# EAGLE board preparedinstruments_0_bechemel_v12_MOTHERBOARD_no_values (EAGLE 9.6.2)
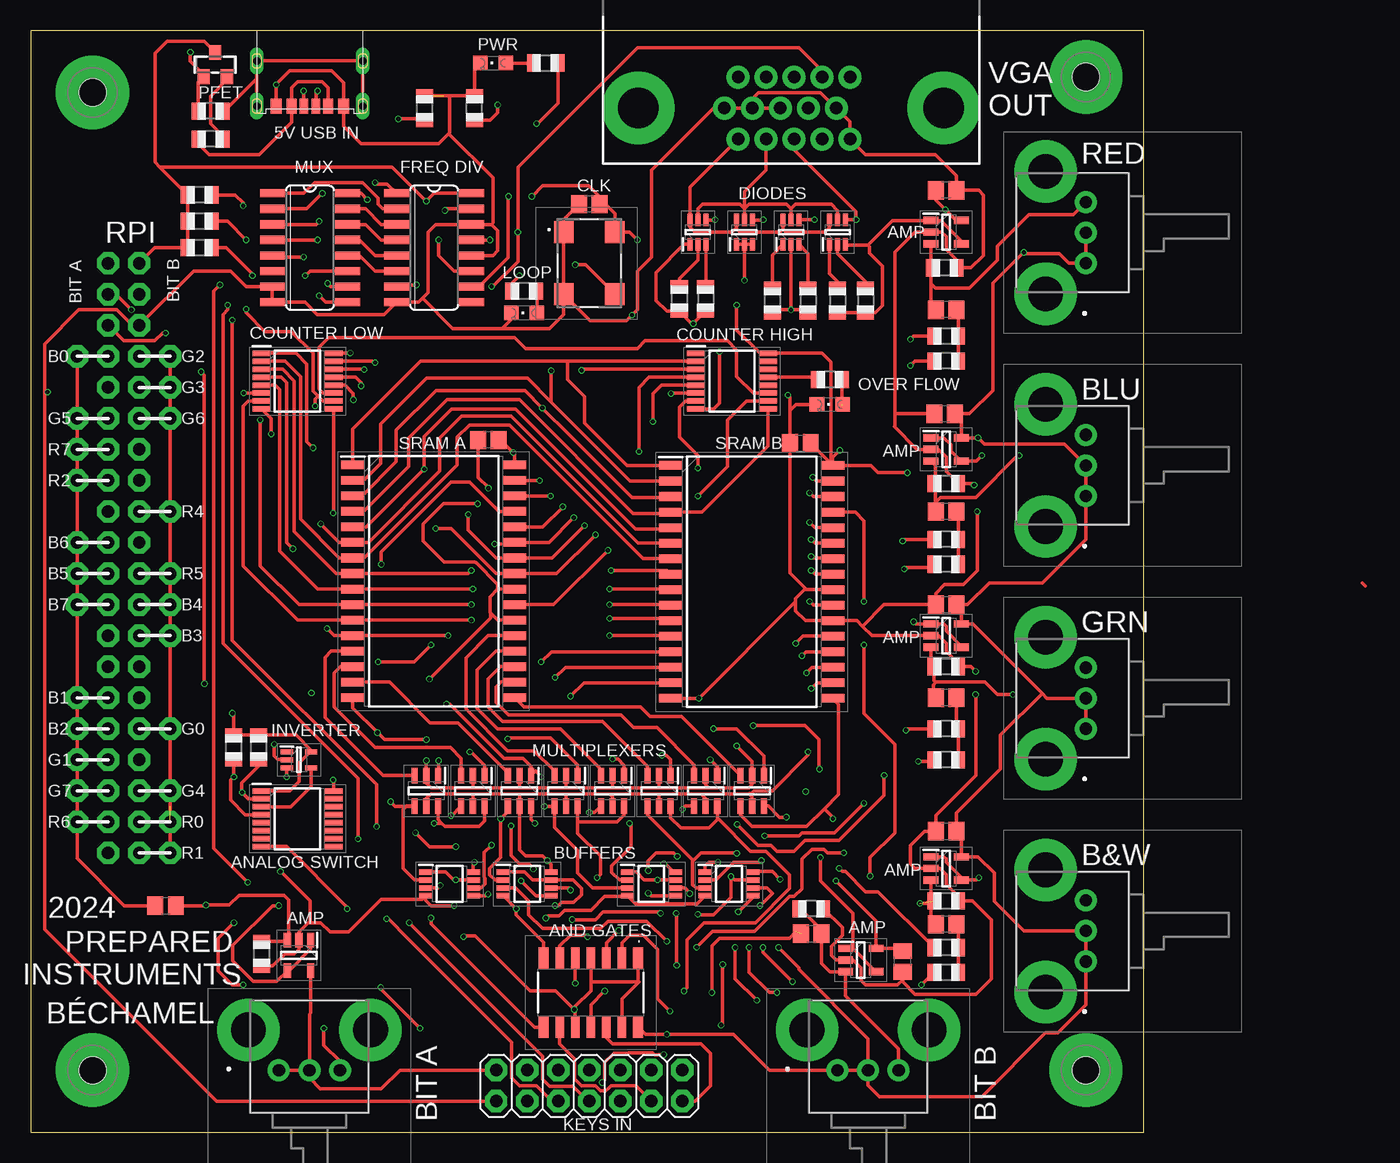
[diagram p5: board, top side]
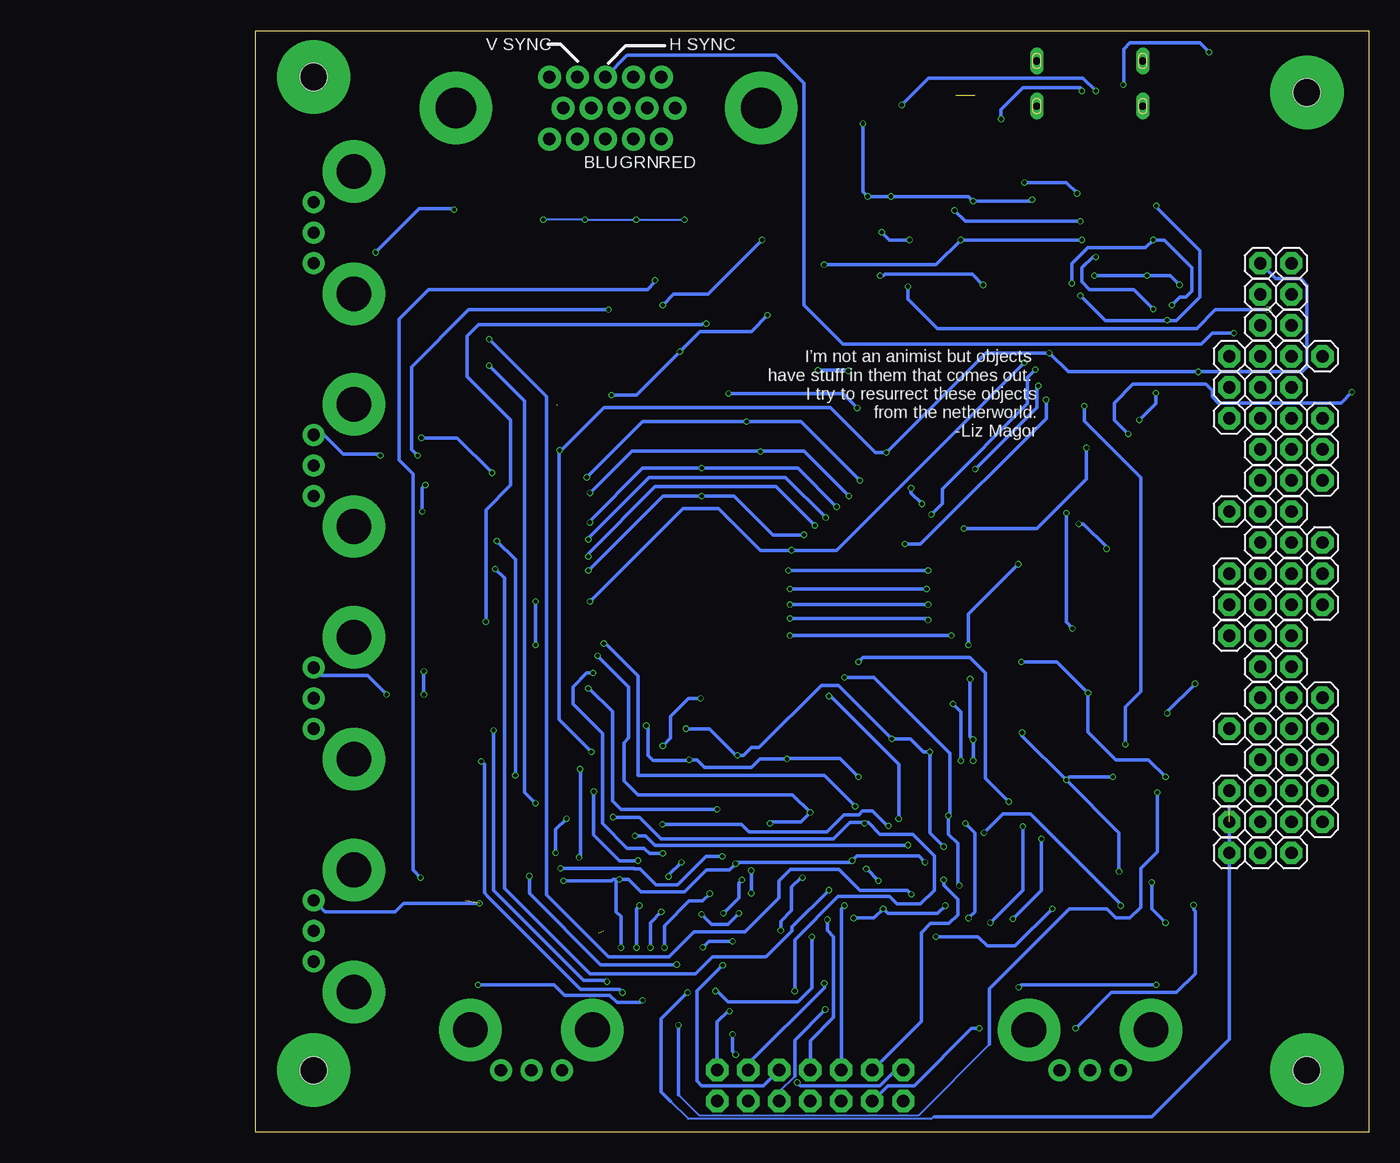
[diagram p6: board, bottom side, seen from below]

Size 91.11 x 90.16 mm. Coordinates in mm from the lower left corner, seen from the top.
Outline: 0,0 91.11,0 91.11,90.16 0,90.16 0,0
Copper layers (1*16): Top 0.035mm / dielectric 1.6mm / Bottom 0.035mm
Design rules "jlcpcb-2layers": minimum track width 5mil, minimum drill 0.3mm, track to track 5mil, track to pad 5mil, pad to pad 5mil, via to via 5mil, smd to smd 5mil, copper to edge 0.2mm, drill to drill 6mil, minimum pad ring 10mil, minimum via ring 3mil, stop-mask expansion 4mil, vias tented up to drill 0mil, thermal gap 10mil

## Footprints (pad centres in the part's own frame; a part is rotated, then mirrored left to right if it is on the bottom)
C0805 = smd 1.3 x 1.5: 1 -0.85,0; 2 0.85,0
SOT65P210X110-6N = smd 1 x 0.4: 1 -1,0.65; 2 -1,0; 3 -1,-0.65; 4 1,-0.65; 5 1,0; 6 1,0.65
R0805 = smd 1.1 x 1.4: 1 -1,0; 2 1,0
SOIC127P1412X305-32N = smd 1.922 x 0.7: 1 -6.614,9.525; 2 -6.614,8.255; 3 -6.614,6.985; 4 -6.614,5.715; 5 -6.614,4.445; 6 -6.614,3.175; 7 -6.614,1.905; 8 -6.614,0.635; 9 -6.614,-0.635; 10 -6.614,-1.905; 11 -6.614,-3.175; 12 -6.614,-4.445; 13 -6.614,-5.715; 14 -6.614,-6.985; 15 -6.614,-8.255; 16 -6.614,-9.525; 17 6.614,-9.525; 18 6.614,-8.255; 19 6.614,-6.985; 20 6.614,-5.715; 21 6.614,-4.445; 22 6.614,-3.175; 23 6.614,-1.905; 24 6.614,-0.635; 25 6.614,0.635; 26 6.614,1.905; 27 6.614,3.175; 28 6.614,4.445; 29 6.614,5.715; 30 6.614,6.985; 31 6.614,8.255; 32 6.614,9.525
SOP65P400X130-8N = smd 1.1 x 0.45: 1 -1.95,0.975; 2 -1.95,0.325; 3 -1.95,-0.325; 4 -1.95,-0.975; 5 1.95,-0.975; 6 1.95,-0.325; 7 1.95,0.325; 8 1.95,0.975
SOT95P275X110-6N = smd 1.25 x 0.5: 1 -1.25,0.95; 2 -1.25,0; 3 -1.25,-0.95; 4 1.25,-0.95; 5 1.25,0; 6 1.25,0.95
SOT95P280X145-5N = smd 1.2 x 0.6: 1 -1.25,0.95; 2 -1.25,0; 3 -1.25,-0.95; 4 1.25,-0.95; 5 1.25,0.95
SO16 = smd 0.66 x 2.032: 1 -4.445,-3.073; 2 -3.175,-3.073; 3 -1.905,-3.073; 4 -0.635,-3.073; 5 0.635,-3.073; 6 1.905,-3.073; 7 3.175,-3.073; 8 4.445,-3.073; 9 4.445,3.073; 10 3.175,3.073; 11 1.905,3.073; 12 0.635,3.073; 13 -0.635,3.073; 14 -1.905,3.073; 15 -3.175,3.073; 16 -4.445,3.073
74LVT08D118 = smd 0.8 x 1.75: 1 -3.86,-2.825; 7 3.86,-2.825; 8 3.86,2.825; 14 -3.86,2.825 | smd 0.7 x 1.75: 2 -2.54,-2.825; 3 -1.27,-2.825; 4 0,-2.825; 5 1.27,-2.825; 6 2.54,-2.825; 9 2.54,2.825; 10 1.27,2.825; 11 0,2.825; 12 -1.27,2.825; 13 -2.54,2.825
SOP65P640X110-16N = smd 1.475 x 0.45: 1 -2.938,2.275; 2 -2.938,1.625; 3 -2.938,0.975; 4 -2.938,0.325; 5 -2.938,-0.325; 6 -2.938,-0.975; 7 -2.938,-1.625; 8 -2.938,-2.275; 9 2.938,-2.275; 10 2.938,-1.625; 11 2.938,-0.975; 12 2.938,-0.325; 13 2.938,0.325; 14 2.938,0.975; 15 2.938,1.625; 16 2.938,2.275
1X01 = drill 1.016 octagon: 1 0,0
2X07 = drill 1.016 octagon: 1 -7.62,-1.27; 2 -7.62,1.27; 3 -5.08,-1.27; 4 -5.08,1.27; 5 -2.54,-1.27; 6 -2.54,1.27; 7 0,-1.27; 8 0,1.27; 9 2.54,-1.27; 10 2.54,1.27; 11 5.08,-1.27; 12 5.08,1.27; 13 7.62,-1.27; 14 7.62,1.27
CHIPLED_0805 = smd 1.2 x 1.2: A 0,-1.05; C 0,1.05
STANDOFF_HEX_FEMALE_400X2000_M2X0.4_MTGP600H220 = drill 2.2 pad 6: 1 0,0 | hole 2.2: 0,0
SOT23-WIDE = smd 1 x 1.2: 1 -0.95,-1; 2 0.95,-1; 3 0,1
SOP65P640X120-16N = smd 1.475 x 0.45: 1 -2.938,2.275; 2 -2.938,1.625; 3 -2.938,0.975; 4 -2.938,0.325; 5 -2.938,-0.325; 6 -2.938,-0.975; 7 -2.938,-1.625; 8 -2.938,-2.275; 9 2.938,-2.275; 10 2.938,-1.625; 11 2.938,-0.975; 12 2.938,-0.325; 13 2.938,0.325; 14 2.938,0.975; 15 2.938,1.625; 16 2.938,2.275
SOT65P210X110-5N = smd 1 x 0.4: 1 -1,0.65; 2 -1,0; 3 -1,-0.65; 4 1,-0.65; 5 1,0.65
DB15 = drill 1.016 pad 1.88: 1 -4.32,-7.62; 2 -2.03,-7.62; 3 0.26,-7.62; 4 2.55,-7.62; 5 4.84,-7.62; 6 -5.46,-5.08; 7 -3.17,-5.08; 8 -0.88,-5.08; 9 1.41,-5.08; 10 3.7,-5.08; 11 -4.32,-2.54; 12 -2.03,-2.54; 13 0.26,-2.54; 14 2.55,-2.54; 15 4.84,-2.54 | drill 3.302 pad 5.08: G1 -12.5,-5.08; G2 12.5,-5.08
USCX-06FX-XXMX-01 = smd 0.7 x 1.2: CC1 0.5,-1.75; CC2 -0.5,-1.75 | smd 0.9 x 1.2: GND1 2.75,-1.75; GND2 -2.75,-1.75 | drill 0.6 long: SHIELD1 4.325,1.95; SHIELD2 4.325,-1.75; SHIELD3 -4.35,-1.75; SHIELD4 -4.35,1.95 | smd 0.8 x 1.2: VBUS1 1.5,-1.75; VBUS2 -1.5,-1.75
PTV09A3015FB103 = drill 1 pad 1.5: 1 0,0; 2 2.5,0; 3 5,0 | drill 2.84 pad 4.3: MH1 -2.5,3.3; MH2 7.5,3.3
LFSPXO019137REEL = smd 1.8 x 1.6: 1 -2.54,-2.1; 2 2.54,-2.1; 3 2.54,2.1; 4 -2.54,2.1

## Placement (x,y rotation side)
C1  .1uF  [C0805]  45.72,75.95 180 top
C2  .1uF  [C0805]  74.93,50.8 180 top
C4  .1uF  [C0805]  63.88,16.26 0 top
C7  .1uF  [C0805]  37.47,56.64 180 top
C12  .1uF  [C0805]  11.05,18.54 0 top
C13  .1uF  [C0805]  74.93,77.09 180 top
C17  .1uF  [C0805]  62.99,56.39 0 top
C18  .1uF  [C0805]  74.93,24.64 0 top
C19  .1uF  [C0805]  71.37,13.97 90 top
C20  .1uF  [C0805]  74.93,43.18 0 top
C21  .1uF  [C0805]  74.8,58.8 0 top
C22  .1uF  [C0805]  74.93,35.56 180 top
C23  .1uF  [C0805]  74.93,17.02 180 top
C24  .1uF  [C0805]  74.93,67.31 180 top
D1  BAS16HTWQ-13  [SOT65P210X110-6N]  66.04,73.66 90 top
D2  BAS16HTWQ-13  [SOT65P210X110-6N]  54.61,73.66 90 top
D3  BAS16HTWQ-13  [SOT65P210X110-6N]  62.23,73.66 90 top
D4  BAS16HTWQ-13  [SOT65P210X110-6N]  58.42,73.66 90 top
FUSE  FUSE  [R0805]  14.73,81.28 180 top
IC1  IS61C5128AS-25QLI  [SOIC127P1412X305-32N]  59.01,45.04 0 top
IC2  74LVC2G125DCTRE6  [SOP65P400X130-8N]  34.29,20.32 0 top
IC3  74LVC2G125DCTRE6  [SOP65P400X130-8N]  40.64,20.32 0 top
IC4  74LVC2G125DCTRE6  [SOP65P400X130-8N]  57.15,20.32 0 top
IC5  74LVC1G157GV-Q100H  [SOT95P275X110-6N]  43.81,27.94 270 top
IC6  74LVC1G157GV-Q100H  [SOT95P275X110-6N]  47.62,27.94 270 top
IC7  74LVC1G157GV-Q100H  [SOT95P275X110-6N]  51.44,27.94 270 top
IC8  74LVC1G157GV-Q100H  [SOT95P275X110-6N]  55.24,27.94 270 top
IC9  74LVC1G157GV-Q100H  [SOT95P275X110-6N]  59.05,27.94 270 top
IC10  74LVC1G157GV-Q100H  [SOT95P275X110-6N]  40.01,27.94 270 top
IC11  74LVC1G157GV-Q100H  [SOT95P275X110-6N]  36.2,27.94 270 top
IC12  74LVC1G157GV-Q100H  [SOT95P275X110-6N]  32.38,27.94 270 top
IC13  THS4221DBVTG4  [SOT95P280X145-5N]  74.93,55.88 0 top
IC14  74AC151D  [SO16]  22.86,72.39 270 top
IC15  THS4221DBVTG4  [SOT95P280X145-5N]  74.93,73.66 0 top
IC16  74LVT08D,118  [74LVT08D118]  45.85,11.43 180 top
IC17  74AC590D  [SO16]  33.02,72.39 270 top
IC18  74HC4040PW,118  [SOP65P640X110-16N]  21.84,61.47 0 top
IC19  74HC4040PW,118  [SOP65P640X110-16N]  57.4,61.47 0 top
IC20  74LVC2G125DCTRE6  [SOP65P400X130-8N]  50.8,20.32 0 top
IC21  THS4221DBVTG4  [SOT95P280X145-5N]  74.93,40.64 0 top
IC22  THS4221DBVTG4  [SOT95P280X145-5N]  21.97,14.48 270 top
IC23  IS61C5128AS-25QLI  [SOIC127P1412X305-32N]  32.99,45.09 0 top
IC24  THS4221DBVTG4  [SOT95P280X145-5N]  67.94,14.1 0 top
IC26  THS4221DBVTG4  [SOT95P280X145-5N]  74.93,21.59 0 top
JP1  [1X01]  3.81,45.72 0 bottom
JP3  [1X01]  3.81,63.5 0 bottom
JP4  [1X01]  3.81,58.42 0 bottom
JP5  [1X01]  3.81,55.88 0 bottom
JP6  [1X01]  3.81,53.34 0 bottom
JP7  [1X01]  3.81,48.26 0 bottom
JP8  [1X01]  3.81,35.56 0 bottom
JP9  [1X01]  3.81,43.18 0 bottom
JP10  [1X01]  3.81,33.02 0 bottom
JP11  [1X01]  3.81,30.48 0 bottom
JP12  [1X01]  3.81,27.94 0 bottom
JP13  [1X01]  3.81,25.4 0 bottom
JP14  [1X01]  11.43,63.5 0 bottom
JP15  [1X01]  11.43,45.72 0 bottom
JP16  [1X01]  11.43,27.94 0 bottom
JP17  [1X01]  11.43,60.96 0 bottom
JP18  [1X01]  11.43,43.18 0 bottom
JP19  [1X01]  11.43,25.4 0 bottom
JP20  [1X01]  11.43,58.42 0 bottom
JP21  [1X01]  11.43,40.64 0 bottom
JP22  [1X01]  11.43,22.86 0 bottom
JP23  [1X01]  11.43,50.8 0 bottom
JP24  [1X01]  11.43,33.02 0 bottom
JP25  [1X01]  6.35,22.86 0 bottom
JP26  [1X01]  8.89,22.86 0 bottom
JP27  [1X01]  6.35,25.4 0 bottom
JP28  [1X01]  8.89,25.4 0 bottom
JP29  [1X01]  6.35,27.94 0 bottom
JP30  [1X01]  8.89,27.94 0 bottom
JP31  [1X01]  6.35,30.48 0 bottom
JP32  [1X01]  8.89,30.48 0 bottom
JP33  [1X01]  6.35,33.02 0 bottom
JP34  [1X01]  8.89,33.02 0 bottom
JP35  [1X01]  6.35,35.56 0 bottom
JP36  [1X01]  8.89,35.56 0 bottom
JP37  [1X01]  8.89,38.1 0 bottom
JP38  [1X01]  6.35,38.1 0 bottom
JP39  [1X01]  6.35,40.64 0 bottom
JP40  [1X01]  8.89,40.64 0 bottom
JP41  [1X01]  6.35,50.8 0 bottom
JP42  [1X01]  8.89,45.72 0 bottom
JP43  [1X01]  8.89,43.18 0 bottom
JP44  [1X01]  6.35,43.18 0 bottom
JP45  [1X01]  8.89,50.8 0 bottom
JP46  [1X01]  8.89,48.26 0 bottom
JP47  [1X01]  6.35,48.26 0 bottom
JP48  [1X01]  6.35,45.72 0 bottom
JP49  [1X01]  6.35,53.34 0 bottom
JP50  [1X01]  6.35,55.88 0 bottom
JP51  [1X01]  6.35,58.42 0 bottom
JP52  [1X01]  6.35,60.96 0 bottom
JP53  [1X01]  8.89,53.34 0 bottom
JP54  [1X01]  8.89,55.88 0 bottom
JP55  [1X01]  8.89,58.42 0 bottom
JP56  [1X01]  8.89,60.96 0 bottom
JP57  [1X01]  8.89,71.12 0 bottom
JP58  [1X01]  6.35,71.12 0 bottom
JP59  [1X01]  6.35,68.58 0 bottom
JP60  [1X01]  8.89,68.58 0 bottom
JP61  [1X01]  6.35,66.04 0 bottom
JP62  [1X01]  8.89,66.04 0 bottom
JP63  [1X01]  6.35,63.5 0 bottom
JP64  [1X01]  8.89,63.5 0 bottom
JP65  [2X07]  45.72,3.81 0 top
LED1  [CHIPLED_0805]  65.41,59.56 90 top
LED2  [CHIPLED_0805]  40.39,67.06 90 top
LED6  [CHIPLED_0805]  37.85,87.5 90 top
MP1  STANDOFF_F/F_M2_20MM  [STANDOFF_HEX_FEMALE_400X2000_M2X0.4_MTGP600H220]  86.36,5.08 0 top
MP2  STANDOFF_F/F_M2_20MM  [STANDOFF_HEX_FEMALE_400X2000_M2X0.4_MTGP600H220]  86.36,86.36 0 top
MP3  STANDOFF_F/F_M2_20MM  [STANDOFF_HEX_FEMALE_400X2000_M2X0.4_MTGP600H220]  5.08,5.08 0 top
MP4  STANDOFF_F/F_M2_20MM  [STANDOFF_HEX_FEMALE_400X2000_M2X0.4_MTGP600H220]  5.08,85.09 0 top
P-FET2  [SOT23-WIDE]  15.11,87.38 0 top
R1  5K  [R0805]  74.93,53.09 180 top
R2  5K  [R0805]  74.93,38.1 180 top
R3  5K  [R0805]  74.8,70.74 180 top
R4  10K  [R0805]  13.84,72.39 180 top
R5  10K  [R0805]  16.64,31.5 90 top
R7  1K  [R0805]  74.93,65.15 180 top
R8  2K  [R0805]  74.93,63.12 180 top
R9  1K  [R0805]  74.93,48.51 180 top
R10  2K  [R0805]  74.93,46.48 180 top
R11  10K  [R0805]  18.67,31.5 90 top
R12  180ohm  [R0805]  65.41,61.59 180 top
R13  10K  [R0805]  13.84,76.71 180 top
R14  ??  [R0805]  66.04,68.07 270 top
R15  180ohm  [R0805]  40.39,68.83 180 top
R16  1K  [R0805]  74.93,30.48 180 top
R17  2K  [R0805]  74.93,33.02 180 top
R18  10K  [R0805]  13.84,74.55 180 top
R19  1K  [R0805]  74.93,15.11 180 top
R20  2K  [R0805]  74.93,13.08 180 top
R21  5K  [R0805]  18.92,14.61 90 top
R22  5K  [R0805]  63.88,18.29 180 top
R23  ??  [R0805]  63.63,68.07 270 top
R24  ??  [R0805]  55.24,68.2 270 top
R25  ??  [R0805]  68.33,68.07 270 top
R26  ??  [R0805]  60.71,68.07 270 top
R27  ??  [R0805]  53.09,68.2 270 top
R28  5K  [R0805]  74.93,18.92 180 top
R30  300 ohm  [R0805]  42.16,87.5 0 top
R42  1M  [R0805]  14.73,83.57 180 top
R43  5k1  [R0805]  36.32,83.82 90 top
R44  5k1  [R0805]  32.26,83.82 90 top
S1  ADG888YRUZ-REEL7  [SOP65P640X120-16N]  21.84,25.65 0 top
U1  74AHCT1G04SE-7  [SOT65P210X110-5N]  21.97,30.48 0 top
U$1  DB15  [DB15]  62.23,88.9 0 top
U$2  USBC-6P  [USCX-06FX-XXMX-01]  22.86,85.72 0 top
VR1  PTV09A-3015F-B103  [PTV09A3015FB103]  20.32,5.08 0 top
VR2  PTV09A-3015F-B103  [PTV09A3015FB103]  86.36,52.07 90 top
VR4  PTV09A-3015F-B103  [PTV09A3015FB103]  86.36,33.02 90 top
VR5  PTV09A-3015F-B103  [PTV09A3015FB103]  86.36,13.97 90 top
VR6  PTV09A-3015F-B103  [PTV09A3015FB103]  66.04,5.08 0 top
VR7  PTV09A-3015F-B103  [PTV09A3015FB103]  86.36,71.12 90 top
Y1  LFSPXO019137REEL  [LFSPXO019137REEL]  45.72,71.12 270 top

## Tracks (layer width: path | path; a pad name or v marks a point on that pad's centre or on a via)
5V?
  Top 0.305: P-FET2.2 16.06,86.12 14.73,84.79 14.73,82.53 15.73,81.53 FUSE.1
!CLK
  Top 0.305: S1.3 21.3,26.63 22.97,28.3 U1.4
_COMP2_OUT  (via drill 0.35)
  Top 0.305: IC22.1 22.92,15 21.15,13.23 IC22.4 20.13,12.34 18.23,12.34 16.55,14.01 16.55,15.29 19.81,18.54 v20.32,18.54 | v35.94,31.11 36.07,31.11 37.15,30.04 IC11.1 | v39.05,32.2 39.05,32.28 42.54,32.28 44.75,30.07 44.75,29.2 IC5.1 | IC7.1 52.38,30.52 52.05,30.85 v51.67,30.85 | IC9.1 60.01,30.8 57.78,33.02 v55.88,33.02 | v34.8,23.37 32.64,23.37 v31.5,24.51
  Bottom 0.305: v20.32,18.54 20.32,18.67 27.69,26.04 29.21,26.04 29.97,26.04 v31.5,24.51 | v55.88,33.02 53.98,33.02 51.8,30.85 v51.67,30.85 51.17,30.85 50.53,31.48 49.9,31.48 44.8,36.58 43.43,36.58 v39.05,32.2 37.52,32.2 36.44,31.11 v35.94,31.11 35.94,24.51 v34.8,23.37
_I/O0  (via drill 0.35)
  Top 0.305: IC1.13 42.63,39.32 v41.78,38.48 | IC2.2 31.43,20.64 30.48,21.59 30.48,26.42 30.75,26.69 IC12.4 31.41,26.67 29.84,26.67 v29.46,27.05
  Bottom 0.305: v41.78,38.48 41.4,38.86 32.64,38.86 31.37,37.59 31.37,28.96 v29.46,27.05
_I/O1  (via drill 0.35)
  Top 0.305: IC11.4 34.46,25.91 v34.42,25.91 | v42.93,37.21 43.77,38.05 IC1.14 | IC2.3 33.33,20 v33.53,20.19
  Bottom 0.305: v42.93,37.21 40.51,37.21 34.29,30.99 34.29,27.81 34.29,27.3 34.29,26.04 v34.42,25.91 34.42,24.38 33.66,23.62 33.66,20.32 v33.53,20.19
_I/O2  (via drill 0.35)
  Top 0.305: IC10.4 39.05,26.23 v38.48,25.65 38.48,22.48 37.58,21.58 37.58,21.07 38.01,20.64 IC3.2 | v44.2,35.69 45.29,36.78 IC1.15
  Bottom 0.305: v38.48,25.65 38.48,30.1 44.07,35.69 v44.2,35.69
_I/O3  (via drill 0.35)
  Top 0.305: IC1.17 66.13,35.01 66.13,27.65 64.96,26.48 | IC9.4 58.1,25.97 59.05,25.02 63.5,25.02 64.96,26.48 | 64.96,26.48 65.66,25.78 v65.66,25.65 | v66.55,22.86 65.23,22.86 64.93,23.16 63.93,23.16 63.12,22.35 63.12,19.93 62.48,19.29 62.1,19.29 59.24,16.43 55.8,16.43 v54.51,15.14 | IC3.3 39.7,20 40.77,18.92 40.77,17.78 41.88,16.66 46.64,16.66 47.24,17.27 50.42,17.27 v52.07,15.62
  Bottom 0.305: v65.66,25.65 66.55,24.77 v66.55,22.86 | v52.07,15.62 54.02,15.62 v54.51,15.14
_I/O4  (via drill 0.35)
  Top 0.305: IC1.18 64.34,36.78 v63.88,36.32 | v53.34,26.42 53.61,26.69 IC8.4 | IC4.2 56.08,20.64 57.53,22.1 59.69,22.1 v59.82,22.23
  Bottom 0.305: v63.88,36.32 63.82,36.32 61.91,34.42 61.91,27.11 61.21,26.42 v53.34,26.42 | v59.82,22.23 61.34,22.23 63.44,24.32 v63.44,27.88
_I/O5  (via drill 0.35)
  Top 0.305: v63.5,37.59 63.96,38.05 IC1.19 | IC7.4 50.48,25.97 54.18,22.27 54.18,22.18 | 54.18,22.18 54.18,20.25 54.44,20 IC4.3 | 54.18,22.18 54.86,22.86 57.74,22.86 v57.78,22.81
  Bottom 0.305: v57.78,22.81 58.88,22.81 59.31,23.24 60.71,23.24 62.74,25.27 62.74,32.64 65.15,35.05 65.15,36.45 64.01,37.59 v63.5,37.59
_I/O6  (via drill 0.35)
  Top 0.305: IC6.4 46.15,26.16 v45.72,26.16 | v63.12,38.99 63.45,39.32 IC1.20 | v49.02,25.27 49.15,25.15 49.15,23.37 47.56,21.78 47.56,21.26 48.18,20.64 IC20.2
  Bottom 0.305: v49.02,25.27 48.9,25.4 46.48,25.4 v45.72,26.16 47.17,27.61 59.82,27.61 60.96,28.76 60.96,29.21 60.96,31.88 60.58,32.26 60.58,36.45 v63.12,38.99
_I/O7  (via drill 0.35)
  Top 0.305: v42.04,26.67 42.84,26.67 IC5.4 42.87,24.95 44.77,23.05 44.77,21.21 45.99,19.99 47.95,19.99 47.96,20 IC20.3 | v62.61,40.01 63.2,40.59 IC1.21
  Bottom 0.305: v42.04,26.67 44.58,29.21 59.82,29.21 59.82,37.34 62.48,40.01 v62.61,40.01
_WE#  (via drill 0.35)
  Top 0.305: R11.1 18.67,29.97 17.27,28.57 17.27,27.81 17.81,27.28 | 17.81,27.28 S1.2 | IC1.29 67.48,50.75 68.2,50.04 v68.2,43.43 | v68.2,39.88 68.2,34.29 70.74,31.75 70.74,24.51 68.71,22.48 v68.71,20.95 | v56.64,13.72 56.64,8.89 v56.52,8.76 | v17.32,27.81 17.81,27.33 17.81,27.28
  Bottom 0.152: 56.52,3.07 54.84,1.4 36.83,1.4 31.05,7.18
  Bottom 0.305: v68.2,43.43 v68.2,39.88 | v68.71,20.95 68.71,19.56 62.87,13.72 v56.64,13.72 | v56.52,8.76 56.52,3.07 | v17.32,27.81 17.32,22.94 18.67,21.59 18.67,18.41 19.56,17.53 20.7,17.53 21.46,18.29 24.51,18.29 30.61,12.19 31.05,11.75 31.05,7.18
A0  (via drill 0.35)
  Top 0.305: v34.16,40.64 IC23.12 24.84,40.64 v24.26,41.23 | v47.37,40.64 52.35,40.64 IC1.12 | IC18.9 24.78,50.69 v24.77,50.67
  Bottom 0.305: v34.16,40.64 v47.37,40.64 | v24.77,50.67 24.77,41.74 v24.26,41.23
A1  (via drill 0.35)
  Top 0.305: v36.07,41.91 v36.06,41.91 IC23.11 21.84,41.91 17.4,46.35 17.4,59.44 17.81,59.84 IC18.7 | v47.37,42.04 52.22,42.04 IC1.11
  Bottom 0.305: v36.07,41.91 36.2,42.04 v47.37,42.04
A2  (via drill 0.35)
  Top 0.305: v36.07,43.18 v36.06,43.18 IC23.10 21.97,43.18 18.8,46.35 v18.8,58.29 | v47.37,43.18 52.35,43.18 IC1.10 | IC18.6 v17.44,60.49
  Bottom 0.305: v36.07,43.18 v47.37,43.18 | v17.44,60.49 17.44,59.65 v18.8,58.29
A3  (via drill 0.35)
  Top 0.305: v36.2,44.45 v36.19,44.45 IC23.9 23.49,44.45 20.37,47.57 20.37,60.78 20.01,61.14 IC18.5 | v47.37,44.45 52.35,44.45 IC1.9
  Bottom 0.305: v36.2,44.45 v47.37,44.45
A4  (via drill 0.35)
  Top 0.305: v36.07,45.97 35.81,45.72 IC23.8 25.02,45.72 21.59,49.15 21.59,61.47 20.61,62.44 IC18.3 | v47.5,45.97 52.09,45.97 IC1.8
  Bottom 0.305: v36.07,45.97 v47.5,45.97
A5
  Top 0.305: IC1.7 50.13,46.94 39.19,57.89 35.94,57.89 34.92,56.87 34.92,54.61 27.31,46.99 IC23.7 25.27,46.99 22.1,50.16 22.1,61.85 20.85,63.09 IC18.2
A6  (via drill 0.35)
  Top 0.305: IC1.6 49.73,48.21 39.34,58.6 35.27,58.6 33.49,56.82 33.49,54.11 27.64,48.26 IC23.6 25.27,48.26 v23.75,49.78 | IC18.4 20.5,61.79 20.95,61.34 20.95,48.26 v21.46,47.75
  Bottom 0.305: v21.46,47.75 21.46,47.88 23.37,49.78 v23.75,49.78
A7  (via drill 0.35)
  Top 0.305: IC23.5 26.39,49.51 27.46,49.51 v32.22,54.27 32.22,56.94 34.46,59.18 39.68,59.18 49.51,49.36 52.27,49.36 IC1.5 | IC18.13 26.6,61.79 27.05,61.34 v27.05,61.09
  Bottom 0.305: v27.05,61.09 27.18,60.96 27.18,59.31 v32.22,54.27
A8  (via drill 0.35)
  Top 0.305: v44.45,50.29 42.42,48.26 IC23.27 39.47,48.13 v37.97,48.13 | v63.88,48.51 64.18,48.21 IC1.27 | v26.42,59.94 26.42,60.45 25.73,61.14 IC18.12
  Bottom 0.305: v44.45,50.29 47.75,53.59 58.93,53.59 63.88,48.64 v63.88,48.51 | v26.42,59.94 26.42,58.42 36.7,48.13 v37.97,48.13
A9  (via drill 0.35)
  Top 0.305: v45.34,49.66 42.68,46.99 IC23.26 38.1,46.99 35.81,49.28 v35.81,50.55 | v63.88,47.12 64.01,46.99 65.58,46.99 IC1.26 | IC18.14 27.27,62.44 v27.3,62.41
  Bottom 0.305: v45.34,49.66 48.51,52.83 58.42,52.83 63.88,47.37 v63.88,47.12 | v27.3,62.41 27.94,61.77 27.94,59.62 34.92,52.63 34.92,51.44 v35.81,50.55
A10  (via drill 0.35)
  Top 0.305: IC23.23 42.8,43.18 v47.24,47.62 | IC1.23 64.05,43.13 v63.75,43.43 | IC18.15 27.97,63.09 28.07,62.99 v28.19,62.99
  Bottom 0.305: v63.75,43.43 56.13,51.05 53.21,51.05 49.78,47.62 v47.24,47.62 43.56,47.62 v28.19,62.99
A11  (via drill 0.35)
  Top 0.305: v46.23,48.9 43.06,45.72 IC23.25 38.1,45.72 34.42,49.4 v33.15,49.4 | v63.88,45.97 64.18,45.67 IC1.25 | IC18.1 21.73,63.74 22.61,62.87 22.61,56.52 v23.11,56.01 | v54.61,52.07 57.02,54.48 57.02,58.29 58.57,59.84 IC19.10
  Bottom 0.305: v46.23,48.9 48.77,48.9 51.94,52.07 v54.61,52.07 57.78,52.07 v63.88,45.97 | v23.11,56.01 23.11,53.47 27.18,49.4 v33.15,49.4
A12
  Top 0.305: IC23.4 27.26,50.8 30.95,54.49 30.95,56.81 34.08,59.94 40.01,59.94 49.32,50.63 52.27,50.63 IC1.4 54.95,50.75 60.34,56.15 IC19.9
A13  (via drill 0.35)
  Top 0.305: IC23.28 41.91,49.53 v43.56,51.18 | v63.75,49.91 64.18,49.48 IC1.28 | IC19.7 53.58,59.84 53.09,59.35 53.09,56.9 54.61,55.37 v54.61,54.36
  Bottom 0.305: v43.56,51.18 46.74,54.36 v54.61,54.36 59.44,54.36 63.75,50.04 v63.75,49.91
A14  (via drill 0.35)
  Top 0.305: IC23.3 27.14,52.07 29.93,54.87 29.93,57.44 33.17,60.68 40.47,60.68 v41.88,59.28 44.1,57.05 49.22,51.93 52.3,51.93 IC1.3 | IC19.6 52.44,60.49 v52.41,60.46
  Bottom 0.305: v41.88,59.28 43.06,60.46 v52.41,60.46
A15  (via drill 0.35)
  Top 0.305: IC23.31 v41.65,53.34 v41.66,53.34 | IC1.31 64.31,53.29 v64.01,53.59 | IC19.5 51.62,61.14 50.93,60.45 v50.93,58.17
  Bottom 0.305: v41.66,53.34 46.48,58.17 v50.93,58.17 59.44,58.17 v64.01,53.59
A16  (via drill 0.35)
  Top 0.305: IC23.2 27.26,53.34 28.66,54.74 28.66,57.95 32.41,61.7 40.66,61.7 42.6,59.75 | IC1.2 49.06,53.29 42.6,59.75 | IC19.3 45.17,62.44 v45.09,62.36 | v42.6,62.31 42.6,59.75
  Bottom 0.305: v45.09,62.36 42.65,62.36 v42.6,62.31
A17
  Top 0.305: IC23.1 26.38,57.53 31.93,63.09 43.94,63.09 | 43.94,63.09 IC19.2 | 43.94,63.09 43.94,61.59 45.34,60.2 45.34,58.04 48.81,54.56 IC1.1
A18  (via drill 0.35)
  Top 0.305: IC23.30 v42.54,52.07 v42.55,52.07 | v63.75,52.32 64.05,52.02 IC1.30 | IC19.4 50.62,61.79 49.78,60.96 v49.78,55.7
  Bottom 0.305: v42.55,52.07 46.23,55.75 49.73,55.75 v49.78,55.7 49.93,55.7 49.98,55.75 60.33,55.75 v63.75,52.32
CLK  (via drill 0.35)
  Top 0.305: IC18.10 23.93,59.84 23.53,60.24 | 23.53,60.24 23.11,60.66 23.11,63.75 21.34,65.53 19.18,65.53 17.65,67.06 v17.65,67.36 | v22.35,71.63 19.91,71.63 IC14.5 | U1.2 20.95,30.5 20.22,30.5 19.94,30.78 v19.94,31.75 | v23.29,59.44 23.29,59.99 23.53,60.24
  Bottom 0.305: v22.35,71.63 22.61,71.63 23.5,70.74 23.5,69.6 22.86,68.96 19.26,68.96 v17.65,67.36 | v19.94,31.75 19.94,34.8 18.67,36.07 18.67,53.59 23.29,58.21 v23.29,59.44
COMP2_OUT  (via drill 0.35)
  Top 0.305: IC24.1 67.3,15.05 | IC24.4 67.3,15.05 | v34.04,35.05 34.29,35.05 38.76,30.59 40.32,30.59 40.95,29.95 IC10.1 41.32,29.55 v41.78,29.08 | v33.38,30.41 33.38,29.24 IC12.1 | v47.62,30.54 48.07,30.54 48.58,30.04 IC6.1 | v55.63,30.48 56.2,29.91 IC8.1 | 67.3,15.05 67.3,17.89 67.31,17.91 64.64,20.57 v64.64,22.48 | v59.13,33.27 63.37,33.27 64.52,32.13 64.52,29.63 64.56,29.68 v64.56,29.72
  Bottom 0.305: v34.04,35.05 33.38,34.4 v33.38,30.41 | v41.78,29.08 43.31,30.61 47.62,30.61 v47.62,30.54 49.85,30.54 50.55,29.84 54.36,29.84 54.99,30.48 v55.63,30.48 55.67,30.43 58.58,30.43 58.98,30.83 58.98,33.12 v59.13,33.27 | v64.64,22.48 64.52,22.61 64.52,29.72 64.56,29.68 v64.56,29.72
COUNTER_RESET
  Top 0.305: IC19.11 59.14,60.49 57.78,61.85 57.78,64.01 57.02,64.77 50.29,64.77 49.66,64.14 40.51,64.14 39.62,65.02 24.38,65.02 23.62,64.26 23.62,60.83 23.96,60.49 IC18.11
DGND  (via drill 0.35)  (1 unrouted)
  Top 0.305: 55.5,28.19 58.8,28.19 59.05,28.45 IC9.2 59.05,30.35 v57.78,31.62 | 55.5,28.19 55.24,28.45 IC8.2 | 55.5,28.19 51.44,28.19 | 51.44,28.19 47.62,28.19 | 47.62,28.19 43.81,28.19 | 43.81,28.19 40.01,28.19 | 40.01,28.19 36.2,28.19 | 36.2,28.19 32.77,28.19 32.38,28.57 IC12.2 v32.38,30.41 | IC11.2 36.2,28.19 | IC10.2 40.01,28.19 | IC5.2 43.81,28.19 | IC6.2 47.62,28.19 | IC7.2 51.44,28.19 | IC23.24 38.23,44.45 | IC23.22 38.22,41.91 37.66,42.48 | 38.23,44.45 37.59,43.81 37.59,42.55 37.66,42.48 | IC1.24 63.5,44.4 | 63.5,44.4 63.33,44.4 62.61,43.69 62.61,43.43 | 62.61,43.43 62.61,42.67 63.42,41.86 IC1.22 67.61,41.86 68.07,41.4 | v32.38,32.13 28.96,32.13 v28.38,32.7 26.38,34.71 IC23.16 | 62.61,43.43 v54.69,35.51 IC1.16 | 37.66,42.48 37.66,42.1 v32.64,37.08 | IC4.4 54.52,18.67 49.53,18.67 IC20.4 48.81,19.3 46.99,19.3 45.85,18.16 43.69,18.16 43.24,17.72 42.35,17.72 v42.16,17.53 | v39.75,18.29 IC3.4 | v39.75,18.29 39.75,18.41 | IC17.12 37.85,71.75 38.23,72.14 38.23,73.79 37.72,74.3 | 37.72,74.3 IC17.14 33.15,74.3 32.51,73.66 32.51,68.71 32.07,68.26 | 32.07,68.26 31.75,67.94 IC17.8 28.93,66.93 23.47,66.93 22.45,67.94 IC14.8 IC14.7 17.65,69.22 16.38,70.48 13.34,70.48 JP62.1 8.76,66.04 8.68,66.12 8.23,66.12 7.04,67.31 3.96,67.31 1.17,64.52 1.17,60.8 | Y1.2 43.62,66.93 42.48,65.79 38.61,65.79 | 32.07,68.26 34.54,65.79 38.61,65.79 | Y1.2 Y1.1 43.62,74.7 C1.2 | U$2.GND2 v20.11,85.72 20.11,85.77 21.21,86.87 24.64,86.87 25.61,85.9 U$2.GND1 25.61,82.34 27.05,80.9 33.4,80.9 34.23,81.72 | U$1.8 U$1.7 | U$1.7 U$1.6 55.88,83.82 50.8,78.74 50.8,71.63 49.66,70.48 49.66,67.31 v49.21,66.86 48.77,66.42 45.78,66.42 Y1.2
  Top 0.305: 22.86,17.14 23.75,17.14 24.51,16.38 26.04,16.38 28.7,19.05 32.05,19.05 IC2.4 32.34,18.96 32.76,18.54 v34.67,18.54 | 22.86,17.14 22.73,17.14 21.97,16.38 IC22.2 21.97,14.99 21.59,14.61 20.83,14.61 19.83,13.61 R21.1 | R44.2 34.29,84.82 34.29,81.79 34.23,81.72 | 33.78,84.82 R43.2 36.32,87.03 LED6.C | 73.44,58.8 C21.1 70.74,58.8 | 70.74,58.8 70.74,72.01 72.39,73.66 IC15.2 74.55,73.66 74.93,73.28 74.93,72.25 75.8,71.37 R3.1 76.96,70.74 77.98,71.75 77.98,76.71 77.6,77.09 C13.1 75.78,78.27 74.04,80.01 68.34,80.01 U$1.5 67.07,82.68 U$1.10 64.66,85.09 59.58,85.09 59.06,84.57 U$1.7 | 70.74,58.8 70.74,57.7 | 70.69,57.73 72.54,55.88 IC13.2 74.3,55.88 74.93,55.24 74.93,54.09 R1.1 77.09,53.09 v77.22,52.96 | 73.93,24.49 C18.1 | R42.2 13.73,85.94 P-FET2.1 14.04,86.5 14.04,86.67 13.08,87.63 v13.08,88.39 | IC16.7 41.99,15.54 39.75,17.78 v39.75,18.29 | 37.72,74.3 37.85,74.42 37.85,78.11 34.23,81.72 | 68.07,41.4 69.85,43.18 C20.1 74.08,44.11 74.8,44.83 76.33,44.83 77.47,45.97 v77.47,50.8 | 68.07,41.4 68.83,40.64 IC21.2 74.28,40.64 74.93,39.99 74.93,39.35 75.93,38.35 R2.1 76.96,38.1 v77.34,37.72 | C18.1 73.15,24.64 72.01,23.5 72.01,21.97 72.39,21.59 IC26.2 74.42,21.59 74.93,21.08 74.93,20.3 75.93,19.3 R28.1 77.09,18.92 78.61,17.4 78.61,12.57 77.34,11.3 72.39,11.3 71.37,12.32 C19.1 71.37,12.48 70.95,12.06 68.33,12.06 67.94,12.45 67.94,13.46 67.31,14.1 IC24.2 65.91,14.1 65.53,14.48 65.53,15.23 65.69,15.38 65.69,15.39 66.42,16.13 66.42,16.75 R22.1 | JP65.1 15.24,2.54 1.17,16.61 1.17,60.8 | IC19.8 55.89,59.19 56.39,59.69 v56.39,63.88 | C18.1 74.08,25.95 77.34,29.21 v77.34,35.81
  Top 0.305: U1.3 20.95,29.81 v20.95,29.08 | v24.77,28.83 24.78,28.81 S1.16 | 38.61,65.79 38.63,65.81 39.34,66.51 LED2.C | IC18.8 19.69,58.41 v19.69,57.15 | v1.39,60.58 1.17,60.8 | 22.86,17.14 22.86,18.92 v20.45,21.34 | 62.14,59.05 C17.1 62.14,45.76 63.5,44.4 | 62.14,59.05 62.14,60.16 v61.98,60.33 | 38.23,44.45 38.23,44.83 36.45,46.61 36.4,46.61 36.35,46.66 33.86,46.66 32.13,48.39 32.13,49.78 33.78,51.44 v36.58,51.44 | v37.47,52.7 37.47,52.74 36.62,53.59 C7.2 | LED1.C 62.65,59.56 62.14,59.05
  Bottom 0.305: v32.38,30.41 v32.38,32.13 32.64,32.38 v32.64,37.08 | v20.11,85.72 20.07,85.77 20.07,88.65 19.56,89.15 13.84,89.15 v13.08,88.39 12.95,88.39 | v34.67,18.54 35.31,17.91 39.37,17.91 v39.75,18.29 40.51,17.53 v42.16,17.53 | v49.21,66.86 50.55,65.53 54.74,65.53 v56.39,63.88 59.94,60.33 v61.98,60.33 | v77.47,50.8 77.47,52.7 v77.22,52.96 | v77.34,35.81 v77.34,37.72 | v20.95,29.08 24.51,29.08 v24.77,28.83 | v19.69,57.15 20.83,58.29 20.83,59.69 19.3,61.21 13.34,61.21 12.83,60.71 12.83,60.2 12.32,59.69 2.28,59.69 v1.39,60.58 | v20.45,21.34 20.45,24.51 v24.77,28.83 | v24.77,28.83 28.38,32.45 v28.38,32.7 | v57.78,31.62 57.15,32.26 57.15,34.04 55.67,35.51 v54.69,35.51 | v36.58,51.44 37.47,52.32 v37.47,52.7
F  (via drill 0.35)
  Top 0.305: IC14.4 v23.5,73.03 | IC17.11 34.67,70.48 33.4,71.75 v33.4,73.03 | Y1.3 45.41,70.99 v44.58,70.99
  Bottom 0.305: v23.5,73.03 v33.4,73.03 35.43,70.99 v44.58,70.99
F/2  (via drill 0.35)
  Top 0.305: IC14.3 23.37,74.3 v23.62,74.55 | v33.91,75.44 34.04,75.56 IC17.15
  Bottom 0.305: v23.62,74.55 33.02,74.55 v33.91,75.44
F/4  (via drill 0.35)
  Top 0.305: IC14.2 22.61,75.56 v23.88,76.83 | v28.19,77.72 28.32,77.6 29.18,77.6 IC17.1
  Bottom 0.305: v23.88,76.83 24.77,77.72 v28.19,77.72
F/8
  Top 0.305: IC14.1 22.35,76.83 23.24,77.72 27.18,77.72 28.45,76.45 28.45,75.95 28.83,75.56 IC17.2
F/16
  Top 0.305: IC14.15 27.43,75.56 28.7,74.3 IC17.3
F/32
  Top 0.305: IC14.14 27.43,74.3 28.7,73.03 IC17.4
F/64
  Top 0.305: IC14.13 26.92,73.03 28.19,71.75 IC17.5
F/128
  Top 0.305: IC14.12 26.92,71.75 28.19,70.48 IC17.6
FSEL_A  (via drill 0.35)
  Top 0.305: v22.48,70.1 22.86,70.48 IC14.11 | v15.49,69.34 14.99,68.83 14.99,23.24 v17.78,20.45 | v16.64,17.14 15.37,15.88 15.37,13.21 16.51,12.06 v17.4,12.06 | v28.66,11.86 28.66,11.73 v31.88,8.51 | R4.1 16,72.39 18.16,70.23 v18.16,70.1
  Bottom 0.305: v22.48,70.1 v18.16,70.1 16.26,70.1 v15.49,69.34 | v17.78,20.45 17.78,18.29 v16.64,17.14 | v17.4,12.06 28.45,12.06 v28.66,11.86 | JP65.3 39.37,3.81 37.21,3.81 32.51,8.51 v31.88,8.51
FSEL_B  (via drill 0.35)
  Top 0.305: v24.3,69.47 24.56,69.22 IC14.10 | JP65.5 42.67,2.54 41.4,3.81 40.01,3.81 39.37,4.45 39.37,7.37 30.99,15.75 29.21,17.53 v29.15,17.46 | v17.65,73.03 16.13,74.55 R18.1 | v26.8,24 26.8,28.96 15.75,40.01 15.75,66.93 16.13,67.31 v16.13,67.69
  Bottom 0.305: v24.3,69.47 24.3,71.07 22.99,72.39 18.29,72.39 v17.65,73.03 16.76,73.03 14.48,70.74 14.48,68.83 14.99,68.33 15.49,68.33 v16.13,67.69 | v29.15,17.46 26.8,19.81 v26.8,24
FSEL_C  (via drill 0.35)
  Top 0.305: JP65.7 45.72,2.41 44.39,3.75 42.48,3.75 41.91,4.32 41.91,6.22 v30.99,17.14 | R13.1 16.76,76.71 17.4,76.07 v17.4,75.82 | IC14.9 24.13,67.94 v23.62,68.45 | v28.32,25.02 28.32,28.45 16.51,40.26 v16.51,66.47
  Bottom 0.305: v23.62,68.45 21.59,66.42 16.56,66.42 | v17.4,75.82 17.4,75.69 13.84,72.14 13.84,68.33 15.75,66.42 16.56,66.42 | v30.99,17.14 28.32,19.81 v28.32,25.02 | v16.51,66.47 16.56,66.42
H_SYNC  (via drill 0.35)
  Top 0.305: JP61.1 7.62,64.77 10.16,64.77 10.79,65.41 v11.05,65.41
  Bottom 0.305: U$1.13 60.71,88.14 48.51,88.14 46.23,85.85 46.23,67.69 43.05,64.52 13.72,64.52 12.83,65.41 v11.05,65.41
I/O0
  Top 0.305: IC23.13 24.6,39.37 24.09,38.86 24.09,33.95 28.85,29.19 IC12.3
I/O1
  Top 0.305: IC11.3 35.24,30.59 34.36,31.48 28.18,31.48 24.85,34.8 24.85,37.6 25.36,38.1 IC23.14
I/O2
  Top 0.305: IC23.15 29.38,36.83 32.7,33.51 34.99,33.51 39.05,29.44 IC10.3
I/O3
  Top 0.305: IC23.17 40.37,34.8 49.91,34.8 50.69,34.02 53.28,34.02 IC9.3
I/O4
  Top 0.305: IC23.18 38.48,36.83 38.1,36.45 38.1,35.18 39.12,34.16 48.31,34.16 49.34,33.13 51.25,33.13 54.3,30.08 IC8.3
I/O5
  Top 0.305: IC23.19 38.46,38.1 37.44,37.09 37.44,34.8 38.61,33.63 46.8,33.63 50.48,29.95 IC7.3
I/O6
  Top 0.305: IC6.3 46.67,29.7 43.37,33 38.23,33 36.55,34.67 36.55,37.85 38.08,39.37 IC23.20
I/O7
  Top 0.305: IC23.21 37.44,40.64 35.63,38.83 35.63,34.65 39.05,31.22 41.21,31.22 42.87,29.57 IC5.3
INT_IN1
  Top 0.305: IC15.3 73.68,70.86 | 73.68,70.86 R3.2 | VR7.3 85.34,75.1 81.71,75.1 79.12,72.52 79.12,71.37 76.83,69.09 74.04,69.09 73.68,69.45 | 73.68,69.45 73.68,69.85 73.68,70.86 | C24.2 73.68,67.71 73.68,69.45
INT_IN2  (via drill 0.35)
  Top 0.305: VR1.3 25.32,5.79 24,7.11 v24,8.51 | C12.2 14.3,18.54 v14.35,18.59 16.26,18.59 17.06,19.39 20.75,19.39 21.11,19.03 21.11,15.81 IC22.3 20.9,15.61 R21.2
  Bottom 0.305: v24,8.51 21.08,11.43 15.75,11.43 14.22,12.95 14.22,18.08 14.35,18.21 v14.35,18.59
INT_IN3
  Top 0.305: VR6.3 71.04,6.81 66.69,11.16 IC24.3 65.42,13.15 64.73,13.84 C4.2 | 64.75,16.24 C4.2 | 64.88,16.41 C4.2 | C4.2 64.73,16.55 62.99,18.29 R22.2
INT_IN4  (via drill 0.35)
  Top 0.305: 73.68,35.96 73.87,35.77 | 73.87,35.77 C22.2 | 74.08,38.25 R2.2 | v80.39,35.81 79.12,35.81 78.11,36.83 74.08,36.83 | R2.2 73.68,38.35 IC21.3 | 74.08,36.83 73.87,36.62 73.87,35.77 | 74.08,36.83 73.93,36.98 R2.2
  Bottom 0.305: VR4.3 85.72,37.38 81.96,37.38 v80.39,35.81
INT_IN5  (via drill 0.35)  (1 unrouted)
  Top 0.305: C23.2 73.68,17.42 IC26.3 73.68,19.12 73.3,18.73 v72.77,18.73
  Bottom 0.305: v72.77,18.73 78.99,18.73 79.69,18.03 85.42,18.03 VR5.3
INT_IN6  (via drill 0.35)
  Top 0.305: v80.9,55.37 80.77,55.37 77.34,51.94 74.46,51.94 74.08,51.57 C2.2 74.06,50.78 74.06,52.96 R1.2 74.06,53.22 74.06,54.55 IC13.3
  Bottom 0.305: v80.9,55.37 81.03,55.5 83.95,55.5 85.52,57.07 VR2.3
KEY_BLUE  (via drill 0.35)
  Top 0.305: IC16.5 v44.58,12.19
  Bottom 0.305: v44.58,12.19 44.58,11.81 50.8,5.59 JP65.12
KEY_BLUE_LATCHED  (via drill 0.35)
  Top 0.305: IC4.7 57.59,20.64 v57.31,20.92 57.31,19.21 55.88,17.78 54.66,17.78 v54.61,17.83 | v56.26,22.1 55.5,22.1 55.2,21.8 IC4.1 | v51.56,17.91 51.44,18.03 46.86,18.03 46.23,17.4 v44.32,17.4
  Bottom 0.305: 56.26,21.97 v56.26,22.1 57.31,21.04 v57.31,20.92 | JP65.8 45.72,7.49 43.81,9.4 43.81,16 44.32,16.51 v44.32,17.4 | v54.61,17.83 53.8,17.02 52.45,17.02 v51.56,17.91
KEY_BW
  Top 0.305: IC16.9 43.31,7.24 44.52,6.03 44.52,4.38 45.09,3.81 46.23,3.81 46.66,3.38 47.07,3.38 47.24,3.56 | JP65.11 49.53,3.81 47.5,3.81 47.24,3.56 | 47.24,3.56
KEY_BW_LATCHED  (via drill 0.35)
  Top 0.305: IC20.1 49.57,21.3 50.22,20.64 v51.31,20.64 IC20.7 | v52.88,13.65 52.88,17.86 v52.83,17.91
  Bottom 0.305: JP65.10 49.53,3.81 54.61,3.81 54.99,4.19 54.99,11.56 52.9,13.65 v52.88,13.65 | v52.83,17.91 51.56,19.18 51.56,20.39 v51.31,20.64
KEY_GREEN
  Top 0.305: IC16.12 47.12,7.75 47.62,7.24 54.86,7.24 55.63,6.48 55.63,3.81 54.36,2.54 JP65.13
KEY_GREEN_LATCHED  (via drill 0.35)
  Top 0.305: IC3.1 40.43,21.3 41.08,20.64 IC3.7 44.38,20.64 45.09,19.94 45.09,19.43 44.45,18.8 43.43,18.8 43.18,18.54 v42.93,18.54
  Bottom 0.305: JP65.6 43.18,18.29 v42.93,18.54
KEY_RED  (via drill 0.35)
  Top 0.305: IC16.2 48.39,15.49 49.02,16.13 50.16,16.13 51.31,14.99 51.31,10.92 v52.32,9.91
  Bottom 0.305: JP65.14 53.34,9.02 52.45,9.91 v52.32,9.91
KEY_RED_LATCHED  (via drill 0.35)
  Top 0.305: IC2.1 33.95,21.3 34.6,20.64 v34.8,20.64 IC2.7
  Bottom 0.305: JP65.4 36.64,9.08 36.64,16.32 35.88,17.08 34.35,17.08 33.66,17.78 33.66,19.05 34.8,20.19 v34.8,20.64
N$1
  Top 0.305: 41.63,68.59 R15.1 41.44,68.78 LED2.A
N$3
  Top 0.305: JP3.1 JP4.1 JP5.1 JP6.1 JP7.1 JP1.1 JP9.1 JP8.1 JP10.1 JP11.1 JP12.1 JP13.1 3.81,22.39 7.66,18.54 C12.1
N$4  (1 unrouted)
  Top 0.305: 66.41,59.48 R12.1
N$5  (via drill 0.35)
  Top 0.305: IC17.7 30.07,69.34 v31.57,69.34 | R15.2 39.39,69.48 v40.01,70.1
  Bottom 0.305: v31.57,69.34 32.46,70.23 39.62,70.23 39.75,70.1 v40.01,70.1
N$6
  Top 0.305: 108.97,44.96 109.22,44.7
N$7  (via drill 0.35)
  Top 0.305: R16.2 73.8,30.35 v72.64,30.35 | IC4.5 59.1,19.22 v57.91,18.03 | v58.8,15.11 58.8,13.08 60.45,11.43 v61.09,11.43
  Bottom 0.305: v72.64,30.35 72.39,30.1 72.39,19.57 72.08,19.27 72.08,19.24 64.53,11.68 61.34,11.68 v61.09,11.43 | v57.91,18.03 58.8,17.14 v58.8,15.11
N$9
  Top 0.305: R30.1 LED6.A
N$10  (via drill 0.35)
  Top 0.305: R17.2 71.75,33.02 v71.63,32.89 | IC4.6 60.27,20 60.71,19.56 v59.69,18.54 | v59.94,15.11 59.94,14.73 v62.36,12.32
  Bottom 0.305: v71.63,32.89 71.63,19.81 64.26,12.45 62.48,12.45 v62.36,12.32 | v59.69,18.54 59.94,18.29 v59.94,15.11
N$13  (via drill 0.35)
  Top 0.305: U$2.CC2 v22.36,85.21 v22.35,85.22 | v38.23,84.07 38.23,83.44 37.61,82.82 R43.1
  Bottom 0.305: v22.35,85.22 23.4,86.26 36.04,86.26 v38.23,84.07
N$17  (via drill 0.35)
  Top 0.305: R19.2 69.36,19.68 68.33,19.68 66.67,21.34 66.42,21.34 v66.17,21.59 | v52.92,22.57 52.63,22.86 51.18,22.86 50.55,22.23 v50.55,21.41 | IC20.5 50.76,19.34 v50.55,19.56
  Bottom 0.305: v52.92,22.57 54.27,22.57 56.6,20.23 58.33,20.23 59.64,21.54 60.1,21.54 60.15,21.59 v66.17,21.59 | v50.55,19.56 v50.55,21.41
N$18
  Top 0.305: U$2.SHIELD4 U$2.SHIELD3 | U$2.SHIELD2 U$2.SHIELD1 U$2.SHIELD4 | R42.1 16.18,84.02 16.25,83.95 18.51,86.22 U$2.SHIELD4
N$20  (via drill 0.35)
  Top 0.305: R20.2 72.91,12.06 v72.9,12.06 | IC20.6 53.54,20 53.98,19.56 v53.94,19.52 | v57.66,15.11 57.66,12.57 v59.44,10.79
  Bottom 0.305: v72.9,12.06 66.67,12.06 65.83,11.22 62.14,11.22 61.55,10.62 59.61,10.62 v59.44,10.79 | v53.94,19.52 54.54,18.92 55.63,18.92 57.66,16.89 v57.66,15.11
N$21  (via drill 0.35)
  Top 0.305: U$2.CC1 23.36,85.08 v23.5,85.22 | R44.1 32.15,82.93 v30.1,82.93
  Bottom 0.305: v23.5,85.22 23.5,85.34 23.62,85.47 28.32,85.47 30.1,83.69 v30.1,82.93
N$24  (via drill 0.35)
  Top 0.305: 36.28,19.3 IC2.5 37.19,19.34 37.32,19.48 v37.45,19.48 | R7.2 72.26,65.15 v72.01,64.9
  Bottom 0.305: v72.01,64.9 67.31,60.2 67.31,19.43 62.23,14.35 57.28,14.35 55.24,16.38 51.05,16.38 48.26,19.18 48.26,20.57 47.32,21.51 43.35,21.51 41.66,19.81 37.78,19.81 v37.45,19.48
N$25  (via drill 0.35)
  Top 0.305: R8.2 72.39,63.12 v72.01,62.74 | IC2.6 36.89,20 37.21,20.32 37.21,20.79 37.12,20.88 37.12,22.9 v37.72,23.5 | v60.07,24.26 62.87,24.26 63.12,24.51 65.79,24.51 v68.2,26.92
  Bottom 0.305: v72.01,62.74 69.09,59.82 69.09,27.81 v68.2,26.92 | v37.72,23.5 58.42,23.5 59.18,24.26 v60.07,24.26
N$26  (via drill 0.35)
  Top 0.305: R9.2 71.5,48.51 v71.37,48.39 | v69.85,29.21 69.85,27.56 66.17,23.88 63.37,23.88 62.48,22.99 61.09,22.99 60.58,23.5 59.51,23.5 v57.82,25.18 | IC3.5 41.36,19.34 v40.13,20.57 | v39.32,25.07 39.32,22.65 39.97,22.01 40.74,22.01 41.15,21.6 v41.15,21.54
  Bottom 0.305: v71.37,48.39 69.85,46.86 v69.85,29.21 | v57.82,25.18 51.35,25.18 50.75,24.59 44.37,24.59 42.97,25.99 41.75,25.99 41.45,26.29 40.64,26.29 39.42,25.07 v39.32,25.07 | v41.15,21.54 41.1,21.54 v40.13,20.57
N$27  (via drill 0.35)
  Top 0.305: R10.2 73.68,46.23 71.63,46.23 v71.5,46.1 | IC3.6 44.01,20 v44.2,19.81
  Bottom 0.305: v71.5,46.1 70.74,45.34 70.74,19.94 63.75,12.95 55.12,12.95 53.72,14.35 49.33,14.35 47.2,16.48 47.2,16.81 v44.2,19.81
N$28  (via drill 0.35)  (2 unrouted)
  Top 0.305: JP22.1 JP16.1 JP24.1 JP21.1 JP18.1 JP15.1 JP23.1 JP20.1 JP17.1 JP14.1 | 62.65,16.42 62.1,15.88 56.39,15.88 55.75,15.24 v55.75,11.43
  Bottom 0.152: 35.56,1.27 35.64,1.27 35.81,1.09 55.7,1.09 57.15,2.54
  Bottom 0.305: JP22.1 11.43,26.67 | JP22.1 11.43,22.65 | JP22.1 11.43,7.62 17.78,1.27 35.56,1.27 | 57.15,2.54 57.91,3.3 57.91,9.27 v55.75,11.43
N$31
  Top 0.305: C24.1 75.93,67.16 R7.1 R8.1
N$32
  Top 0.305: C22.1 75.78,33.17 R17.1 R16.1
N$33
  Top 0.305: R9.1 75.93,48.26 | 75.93,48.26 R10.1 | C2.1 75.93,50.65 75.93,48.26
N$34
  Top 0.305: R20.1 R19.1 75.93,16.87 C23.1
N$35
  Top 0.305: R26.1 60.71,71.79 D3.1
N$36
  Top 0.305: D1.1 65.39,70.25 66.04,69.6 R14.1
N$37
  Top 0.305: D1.2 66.04,71.88 68.33,69.6 R25.1
N$38
  Top 0.305: D2.3 55.26,69.21 R24.1
N$39
  Top 0.152: 57.77,74.03 57.72,73.98 | 61.58,73.91 61.58,73.9
  Top 0.305: 57.77,74.03 D4.6 | D3.6 61.58,73.91 61.83,73.66 65.02,73.66 65.39,74.03 D1.6 | 61.58,73.9 61.34,73.66 58.04,73.66 57.72,73.98 57.4,73.66 54.36,73.66 53.96,74.06 D2.6 53.96,77.33 U$1.1
N$41
  Top 0.305: R27.1 53.09,69.85 54.61,71.37 D2.2
N$42
  Top 0.305: D3.3 63.63,71.91 R23.1
N$43
  Top 0.152: 57.66,75.95 57.15,75.95
  Top 0.305: D3.5 62.23,75.56 | 62.23,75.56 62.61,75.95 65.53,75.95 66.04,75.44 D1.5 | 62.23,75.56 61.85,75.95 58.8,75.95 58.42,75.56 | D2.5 54.61,75.56 54.99,75.95 57.15,75.95 58.04,75.95 58.42,75.56 | U$1.2 60.2,78.74 58.42,76.96 58.42,75.56 | D4.5 58.42,75.56
N$44  (via drill 0.35)
  Top 0.152: D3.4 62.9,74.68 | 66.71,74.68 D1.4 | v59.96,74.68 59.94,74.66 | v56.02,74.68 56.01,74.66
  Top 0.305: 62.9,74.68 v64.15,74.68 | 59.94,74.66 D4.4 | 56.01,74.66 D2.4 | U$1.3 62.49,80.42 67.56,75.34 v67.56,74.68 66.71,74.68
  Bottom 0.152: v67.56,74.68 v64.15,74.68 v59.96,74.68 v56.02,74.68
OVERFLOW
  Top 0.305: IC19.13 64.21,61.79 R12.2
POST_FINAL_AMP1  (via drill 0.35)
  Top 0.305: IC26.1 74.74,22.54 74.93,22.35 74.93,22.1 76.18,20.85 IC26.4 77.41,20.64 v77.6,20.83 | D4.1 D4.2 | D4.2 D4.3 | D4.2 v58.42,69.72
  Bottom 0.305: v77.6,20.83 78.23,21.46 78.23,53.85 79.38,54.99 79.38,66.55 76.96,68.96 59.05,68.96 58.42,69.6 v58.42,69.72
POST_FINAL_AMP_BLUE
  Top 0.305: IC15.4 76.07,72.71 76.07,73.03 74.49,74.61 IC15.1 70.55,74.61 68.52,72.59 | R14.2 R25.2 69.15,67.07 69.71,67.63 69.71,70.89 68.65,71.95 68.65,72.46 68.52,72.59 | D1.3 66.76,72.59 68.52,72.59
POST_FINAL_AMP_GREEN  (via drill 0.35)
  Top 0.305: IC13.1 74.74,56.83 75.31,56.26 75.31,55.75 76.13,54.93 IC13.4 77.41,54.93 v77.85,55.37 | v62.23,67.31 63.5,67.31 63.5,67.2 R23.2 | D3.2 v62.23,67.31 | R26.2 60.94,67.31 v62.23,67.31
  Bottom 0.305: v77.85,55.37 78.36,55.88 78.36,62.61 73.66,67.31 v62.23,67.31
POST_FINAL_AMP_RED  (via drill 0.35)
  Top 0.305: IC21.4 76.18,39.77 74.93,41.02 74.93,41.4 74.74,41.59 IC21.1 72.46,41.59 v72.26,41.78 | D2.1 53.48,72.66 51.18,70.36 51.18,68.07 52.07,67.18 53.07,67.18 R27.2 54.1,66.18 v54.23,66.18 R24.2
  Bottom 0.305: v72.26,41.78 72.26,50.93 70.23,52.96 70.23,58.29 73.79,61.85 73.79,65.15 72.85,66.09 54.58,66.09 54.48,66.18 v54.23,66.18
PRE_FUSE
  Top 0.305: 24.36,84.45 U$2.VBUS1 24.36,85.5 23.88,85.98 21.84,85.98 21.36,85.5 U$2.VBUS2 21.36,82.68 18.69,80.01 14.61,80.01 13.73,80.88 FUSE.2
REC/PB  (via drill 0.35)
  Top 0.305: IC16.1 49.71,12.24 | 49.71,12.24 49.78,12.32 45.85,12.32 | 49.71,12.24 48.39,10.92 IC16.13 | IC16.10 44.58,10.16 | 44.58,10.16 44.58,10.29 45.85,11.56 45.85,12.32 | IC16.4 45.85,12.32 | 44.58,10.16 44.5,10.08 v44.5,10.04 42.98,11.56 40.89,11.56 36.39,16.07 35.5,16.07 v35.43,16 | S1.8 20.94,23.38 25.91,18.41 v25.91,18.29
  Bottom 0.152: 48.26,3.3 46.99,4.57
  Bottom 0.305: JP65.9 48.26,3.3 | v44.5,10.04 46.99,7.54 46.99,4.57 | v25.91,18.29 28.96,15.24 31.24,15.24 32,16 v35.43,16
S_IO1  (via drill 0.35)
  Top 0.305: IC12.6 33.34,25.59 33.66,25.27 | IC11.6 37.15,25.46 36.7,25.02 33.91,25.02 33.66,25.27 | 33.66,25.27 v33.02,25.27 | IC16.8 41.23,8.61 32.77,17.06 v32.77,17.53
  Bottom 0.305: v32.77,17.53 32.26,18.03 32.26,24.51 v33.02,25.27
S_IO3  (via drill 0.35)
  Top 0.305: IC9.6 60.39,26.69 61.3,25.78 v61.85,25.78 | v41.27,25.27 40.95,25.59 IC10.6 | IC16.11 45.85,10.41 v46.99,11.56
  Bottom 0.305: v61.85,25.78 59.69,25.78 57.91,24 43.81,24 42.48,25.34 41.34,25.34 | v41.27,25.27 41.34,25.34 | 41.34,25.34 40.96,25.34 40.01,24.38 37.72,24.38 37.34,24.38 35.56,22.61 35.56,19.81 36.7,18.67 38.61,18.67 39.24,19.3 43.43,19.3 46.99,15.75 v46.99,11.56
S_IO5  (via drill 0.35)
  Top 0.305: IC7.6 52.38,25.72 53.21,24.89 55.5,24.89 56.2,25.59 | 56.2,25.59 IC8.6 | 56.2,25.59 56.33,25.59 58.93,22.99 60.2,22.99 62.1,21.08 62.1,19.94 59.31,17.14 55.12,17.14 53.72,15.75 53.72,11.81 v53.47,11.56 | IC16.6 43.31,15.24 44.18,16.11 45.47,16.11 v45.59,15.98
  Bottom 0.305: v45.59,15.98 45.59,11.81 46.74,10.67 52.45,10.67 53.34,11.56 v53.47,11.56
S_IO7  (via drill 0.35)
  Top 0.305: IC5.6 44.77,25.4 | 44.77,25.4 48.01,25.4 48.58,25.97 IC6.6 | 44.77,25.4 44.77,24.46 46.62,22.6 46.62,21.1 v46.35,20.83 | IC16.3 47.12,15.49 v48.13,16.51
  Bottom 0.305: v48.13,16.51 48.13,17.27 47.24,18.16 47.24,20.07 46.48,20.83 v46.35,20.83
V_SYNC  (via drill 0.35)
  Top 0.305: v37.72,69.22 37.78,69.15 39.88,71.25 v39.88,73.66 39.88,78.99 49.66,88.77 62.88,88.77 64.78,86.87 U$1.14 | v8.26,67.31 6.99,68.58 JP59.1 | IC17.13 v37.59,73.03
  Bottom 0.305: v37.72,69.22 37.72,68.2 35.31,65.79 14.1,65.79 12.57,67.31 v8.26,67.31 | v37.59,73.03 39.24,73.03 v39.88,73.66
VCCIO  (via drill 0.35)
  Top 0.305: IC12.5 32.38,27.3 32.77,27.69 36.07,27.69 | 36.07,27.69 36.2,27.56 IC11.5 | 36.07,27.69 39.88,27.69 | 39.88,27.69 40.01,27.56 IC10.5 40.01,23.11 40.51,22.61 41.91,22.61 v42.29,22.23 42.59,21.93 IC3.8 | 39.88,27.69 43.69,27.69 | 43.69,27.69 43.81,27.56 IC5.5 | 43.69,27.69 47.37,27.69 | IC6.5 47.62,27.43 47.37,27.69 | 47.37,27.69 51.31,27.69 | 51.31,27.69 51.44,27.56 IC7.5 | 51.31,27.69 54.86,27.69 | 54.86,27.69 55.24,27.3 IC8.5 | 54.86,27.69 58.8,27.69 | 58.8,27.69 59.05,27.43 IC9.5 | IC1.32 65.5,54.69 65.5,63.02 64.77,63.74 IC19.16 59.7,63.74 57.78,65.66 v57.78,67.69 | v66.24,55.81 65.62,55.2 65.62,54.61 | 65.62,54.61 IC1.32 | IC17.16 33.02,76.83 v32.38,76.2 29.59,78.99 10.56,78.99 | v27.56,76.33 27.05,76.83 IC14.16 | v41.02,76.58 41.91,77.47 45.68,77.47 46.57,76.58 C1.1 47.06,75.95 47.82,75.18 Y1.4 49.02,73.66 v49.66,73.03 | C19.2 71.15,15.05 IC24.5 69.19,17.29 v65.91,20.57 | IC2.8 36.2,21.34 36.2,21.84 36.32,21.97 v36.32,22.1 | v51.82,21.97 51.86,21.93 51.99,21.93 52.62,21.3 IC20.8 | v61.34,20.7 60.71,21.34 59.14,21.34 IC4.8 | VR1.1 VR1.2 | VR1.2 22.82,9.65 22.92,9.75 IC22.5 | VR6.2 VR6.1 60.45,5.08 57.53,8 v52.07,8 50.31,8 IC16.14 | VR6.2 68.54,7.66 62.87,13.34 62.87,13.46 v61.21,15.11 | VR7.2 VR7.1 84.96,71.12 84.2,71.88 81.41,71.88 v81.28,72.01 78.74,69.47 78.74,60.71 76.83,58.8 C21.2 76.18,58.27 IC13.5 v77.55,56.83 78.06,56.32 84.61,56.32 VR2.2 VR2.1 86.36,48.51 82.8,44.96 78.45,44.96 76.67,43.18 C20.2 76.18,42.78 IC21.5 77.11,41.59 82.78,35.92 | VR4.1 VR4.2 83.19,35.52 82.78,35.92 | VR1.2 22.82,4.45 23.71,3.56 28.7,3.56 30.23,5.08 JP65.2 | P-FET2.3 14.21,89.28 11.18,89.28 10.18,88.28 10.18,79.37 10.56,78.99
  Top 0.305: R30.2 43.16,84.2 41.46,82.5 v41.4,82.55 | JP57.1 10.16,72.39 R4.2 R18.2 R13.2 10.56,78.99 | C13.2 74.08,76.29 v74.87,75.5 75.76,74.61 IC15.5 | 82.78,35.92 79.38,32.51 79.38,29.72 75.78,26.12 C18.2 76.18,24.24 IC26.5 77.53,22.54 78.87,21.21 78.87,18.88 81.28,16.47 VR5.2 VR5.1 86.36,10.41 84.07,8.13 83.06,8.13 77.85,2.92 69.47,2.92 68.54,3.85 VR6.2 | IC1.32 68.77,54.56 69.36,53.97 v71.75,53.97 | IC18.16 24.82,63.78 v26.16,63.78 | IC23.32 39.6,55.52 v39.5,55.63 38.48,56.64 C7.1 | v46.79,4.06 46.99,4.27 46.99,5.71 47.75,6.48 48.9,6.48 48.93,6.51 50.89,6.51 51.05,6.35 v51.82,6.35 | 58.8,27.69 58.85,27.74 58.99,27.74 59.19,27.94 60.71,27.94 63.63,30.86 v63.63,31.11 | S1.1 21.2,27.93 21.97,28.7 21.97,30.23 22.88,31.13 U1.5 22.97,31.26 21.73,32.5 R11.2 R5.2 16.64,34.16 v16.51,34.29 | v13.97,62.23 14.22,61.98 v14.22,36.7 | IC17.10 36.7,69.22 39.06,71.58 39.06,76.53 v39.12,76.58 | C17.2 65.62,54.61
  Bottom 0.305: v27.56,76.33 27.69,76.2 v32.38,76.2 32.77,76.58 v39.12,76.58 v41.02,76.58 41.4,76.96 v41.4,82.55 | v36.32,22.1 36.83,22.61 41.91,22.61 v42.29,22.23 42.42,22.1 51.69,22.1 v51.82,21.97 52.32,21.46 54.23,21.46 56.01,19.68 59.56,19.68 60.58,20.7 v61.34,20.7 | v61.34,20.7 61.85,20.7 61.98,20.57 v65.91,20.57 | v61.21,15.11 61.21,17.65 61.59,18.03 61.59,20.45 v61.34,20.7 | v81.28,72.01 77.72,75.56 74.93,75.56 v74.87,75.5 | v71.75,53.97 74.61,56.83 v77.55,56.83 | v49.66,73.03 54.1,68.58 56.9,68.58 v57.78,67.69 | JP57.1 7.62,69.85 5.59,69.85 5.08,69.34 5.08,62.61 5.46,62.23 v13.97,62.23 24.62,62.23 v26.16,63.78 31.35,63.78 v39.5,55.63 40.39,55.63 44.07,59.31 62.61,59.31 66.17,55.75 v66.24,55.81 66.29,55.75 66.29,33.78 v63.63,31.11 | JP65.2 38.73,5.08 40.01,3.81 46.53,3.81 v46.79,4.06 | v51.82,6.35 52.07,6.6 v52.07,8 | v14.22,36.7 16.51,34.42 v16.51,34.29
WE#  (via drill 0.35)
  Top 0.305: IC23.29 38.35,50.8 35.94,53.21 34.42,53.21 28.7,47.5 v28.7,46.48 | S1.4 17.58,25.98 16.38,27.18 16.38,28.83 v16.64,29.08 R5.1 | v32.77,39.88 31.37,38.48 v28.45,38.48
  Bottom 0.305: v16.64,29.08 18.03,30.48 20.7,30.48 22.99,32.77 v22.99,35.94 25.53,38.48 v28.45,38.48 | v28.7,46.48 32.77,42.42 v32.77,39.88

## Text on the board
tPlace: PWR | VGA | PFET | OUT | 5V USB IN | RED | MUX | FREQ DIV | CLK | DIODES | RPI | AMP | BIT B | BIT A | LOOP | COUNTER LOW | COUNTER HIGH | B0 | G2 | OVER FL0W | G3 | BLU | G5 | G6 | SRAM A | SRAM B | R7 | AMP | R2 | R4 | B6 | B5 | R5 | B7 | B4 | GRN | B3 | AMP | B1 | B2 | G0 | INVERTER | MULTIPLEXERS | G1 | G7 | G4 | R6 | R0 | R1 | ANALOG SWITCH | BUFFERS | B&W | AMP | 2024 | PREPARED / INSTRUMENTS | AMP | AND GATES | AMP | BÉCHAMEL | BIT A | BIT B | KEYS IN
bPlace: H SYNC | V SYNC | RED | GRN | BLU | I’m not an animist but objects / have stuff in them that comes out. / I try to resurrect these objects / from the netherworld. / -Liz Magor